# EAGLE design motorBridge (EAGLE 4.16)
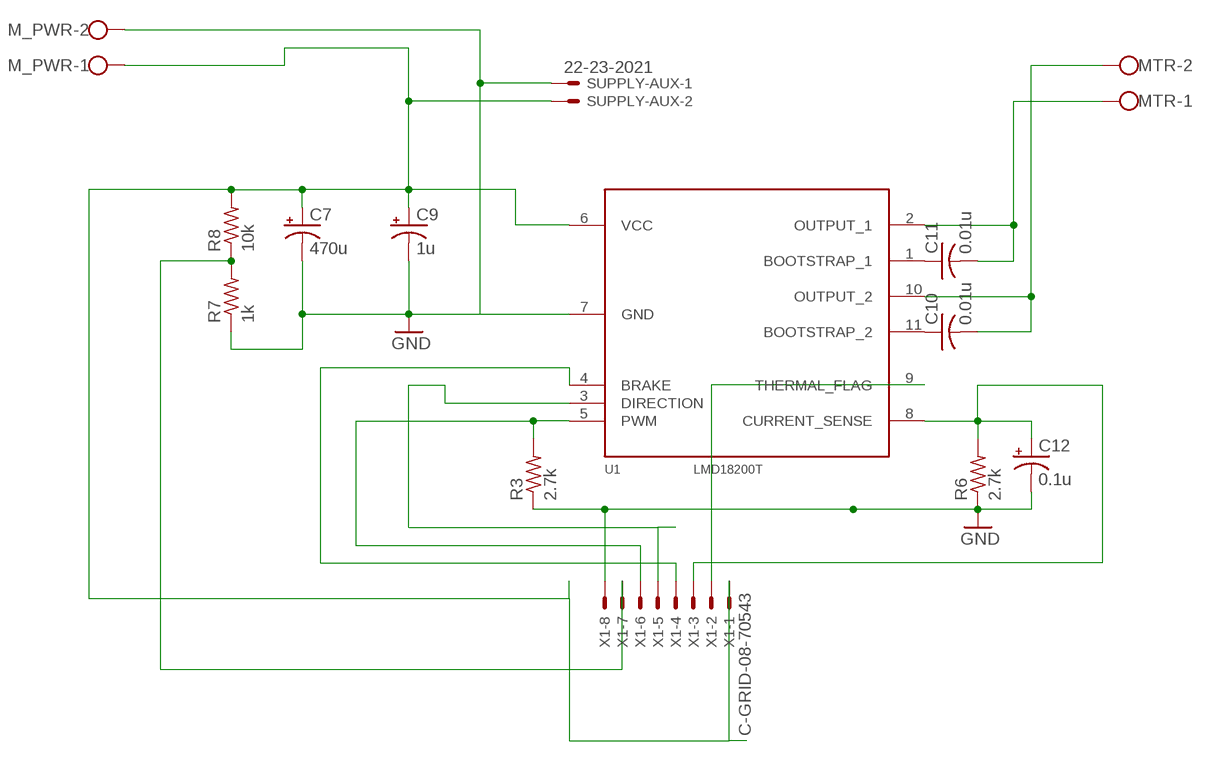
[diagram p0: schematic, sheet 1]

## Parts
C7  470u  CPOL-USE3.5-10  [E3,5-10]
C9  1u  CPOL-USE2.5-7  [E2,5-7]
C10  0.01u  C-US025-025X050  [C025-025X050]
C11  0.01u  C-US025-025X050  [C025-025X050]
C12  0.1u  CPOL-USE2.5-6  [E2,5-6]
M_PWR  W237-02P  [W237-132]
MTR  W237-02P  [W237-132]
R3  2.7k  R-US_0204/7  [0204/7]
R6  2.7k  R-US_0204/5  [0204/5]
R7  1k  R-US_0204/5  [0204/5]
R8  10k  R-US_0204/2V  [0204V]
SUPPLY-AUX  22-23-2021  [22-23-2021]
U1  LMD18200T  [TO-220-11]
X1  C-GRID-08-70543  [70543-08]

## Nets
GND: C7.- C9.- C12.- M_PWR.2 R3.1 R6.1 R7.1 SUPPLY-AUX.1 U1.7(GND) X1.8
N$1: R7.2 R8.1 X1.7
N$2: U1.9(THERMAL_FLAG) X1.2
N$4: C10.2 MTR.2 U1.10(OUTPUT_2)
N$5: C11.2 MTR.1 U1.2(OUTPUT_1)
N$11: C12.+ R6.2 U1.8(CURRENT_SENSE) X1.3
N$31: U1.3(DIRECTION) X1.5
N$55: C7.+ C9.+ M_PWR.1 R8.2 SUPPLY-AUX.2 U1.6(VCC) X1.1
N$63: U1.4(BRAKE) X1.4
N$168: C11.1 U1.1(BOOTSTRAP_1)
N$169: C10.1 U1.11(BOOTSTRAP_2)
N$172: R3.2 U1.5(PWM) X1.6

## Library data of the parts
C7 C9 C12 = rcl:CPOL-US: POLARIZED CAPACITOR, American symbol
C10 C11 = rcl:C-US: CAPACITOR, American symbol
M_PWR MTR = con-wago-508:W237-02P: WAGO SREW CLAMP
R3 R6-R8 = rcl:R-US_: RESISTOR, American symbol
SUPPLY-AUX = con-molex:22-23-2021: .100" (2.54mm) Center Header - 2 Pin
U1 = lmd1820x:LMD18200: National Semiconductor LMD18200 3A, 55V H-Bridge
X1 = con-molex:C-GRID-08: CONNECTOR wire to board 2.54 mm (0.100") pitch header

## Board
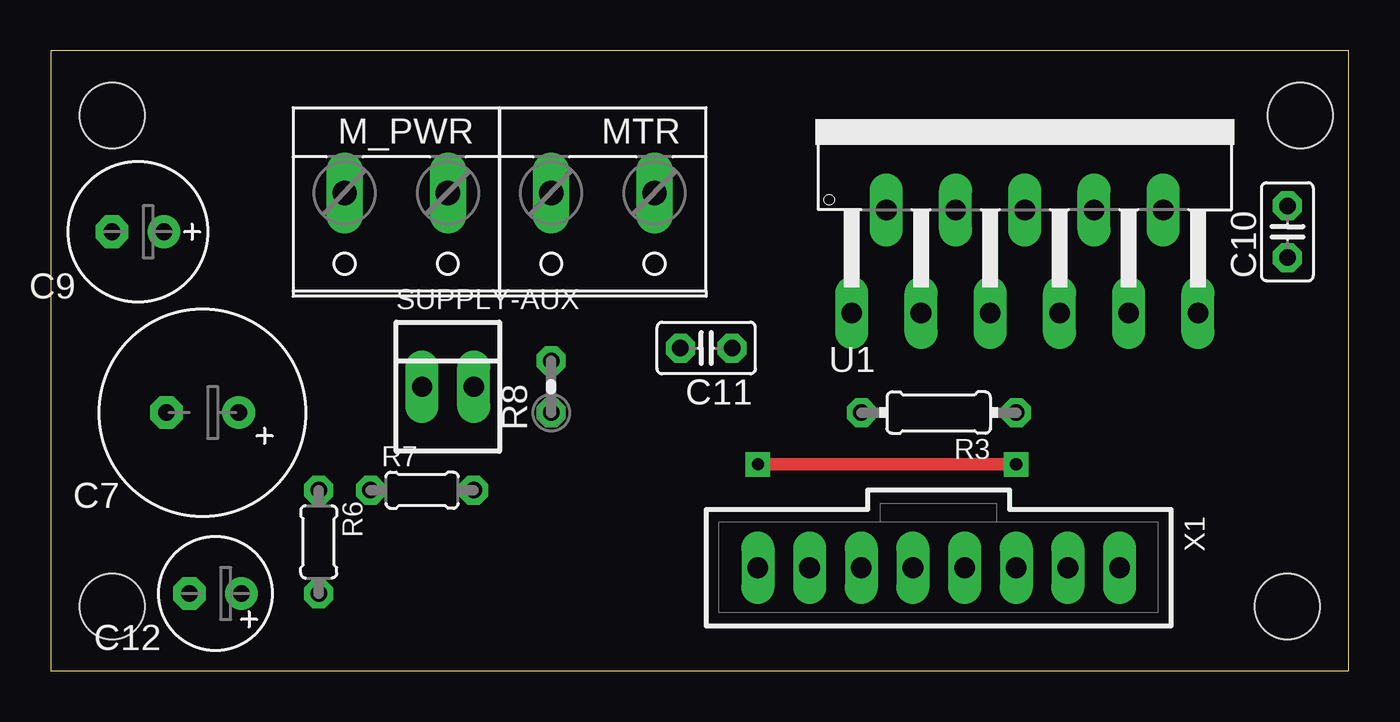
[diagram p1: board, top side]
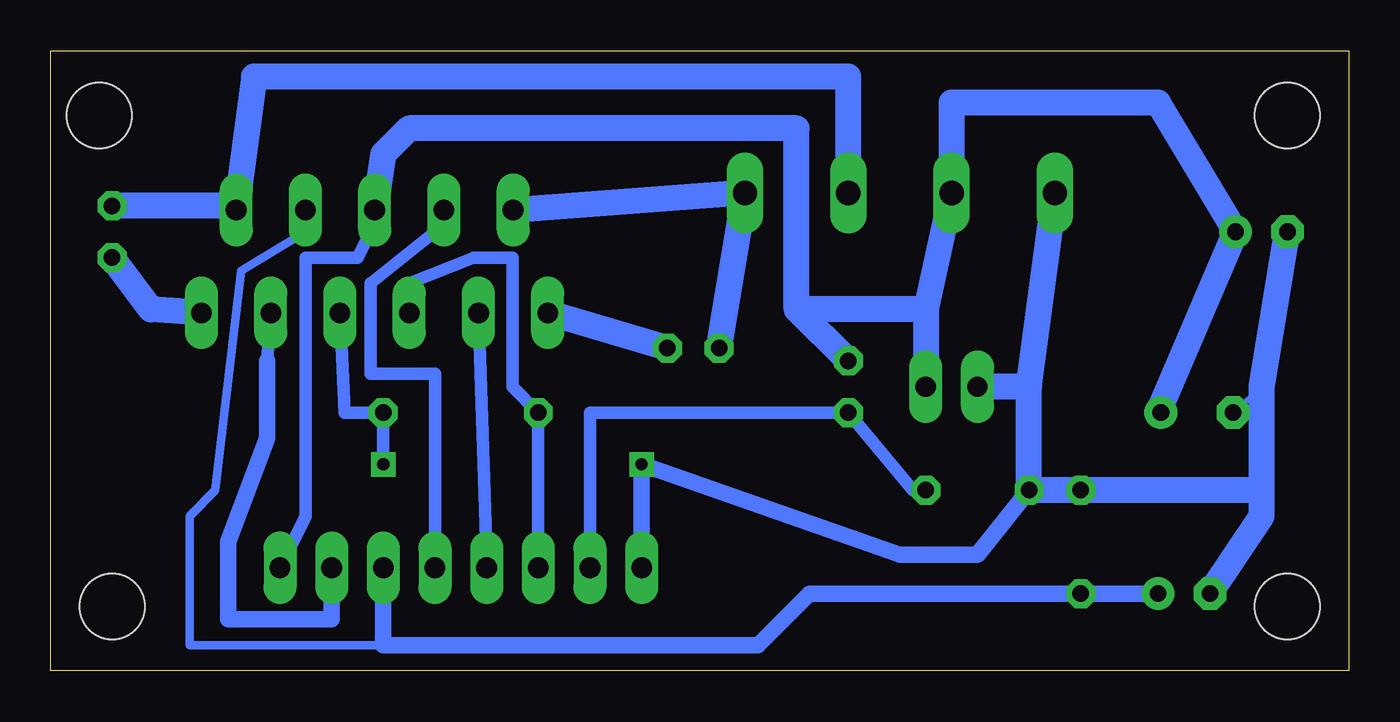
[diagram p2: board, bottom side, seen from below]

Size 63.8 x 30.47 mm. Coordinates in mm from the lower left corner, seen from the top.
Outline: 0,0 63.8,0 63.8,30.47 0,30.47 0,0
Copper layers (1*16): Top 0.035mm / dielectric 1.5mm / Bottom 0.035mm
Design rules "dave": minimum track width 12mil, minimum drill 24mil, track to track 12mil, track to pad 12mil, pad to pad 12mil, via to via 12mil, smd to smd 8mil, copper to edge 40mil, drill to drill 12mil, minimum pad ring 12mil, minimum via ring 12mil, stop-mask expansion 4mil, vias tented up to drill 0mil, thermal gap 10mil
Holes 3.2 mm at 3.01,27.3 61.43,27.3 60.8,3.17 3.01,3.17

### Footprints (pad centres in the part's own frame; a part is rotated, then mirrored left to right if it is on the bottom)
E3,5-10 = drill 0.813 pad 1.6 round: + -1.778,0 | drill 0.813 pad 1.6 octagon: - 1.778,0
E2,5-7 = drill 0.813 pad 1.6 round: + -1.27,0 | drill 0.813 pad 1.6 octagon: - 1.27,0
C025-025X050 = drill 0.813 octagon: 1 -1.27,0; 2 1.27,0
E2,5-6 = drill 0.813 pad 1.6 round: + -1.27,0 | drill 0.813 pad 1.6 octagon: - 1.27,0
W237-132 = drill 1.194 long: 1 -2.54,-0.635; 2 2.54,-0.635
0204/7 = drill 0.813 octagon: 1 -3.81,0; 2 3.81,0
0204/5 = drill 0.813 octagon: 1 -2.54,0; 2 2.54,0
0204V = drill 0.813 octagon: 1 -1.27,0; 2 1.27,0
22-23-2021 = drill 1 long: 1 -1.27,0; 2 1.27,0
TO-220-11 = drill 1.016 long: 1 -8.084,-2.718; 2 -6.382,2.337; 3 -4.68,-2.718; 4 -2.978,2.337; 5 -1.276,-2.718; 6 0.425,2.337; 7 2.127,-2.718; 8 3.829,2.337; 9 5.531,-2.718; 10 7.233,2.337; 11 8.934,-2.718
70543-08 = drill 1.016 long: 1 -8.89,0; 2 -6.35,0; 3 -3.81,0; 4 -1.27,0; 5 1.27,0; 6 3.81,0; 7 6.35,0; 8 8.89,0

### Placement (x,y rotation side)
C7  7.46,12.69 180 top
C9  4.28,21.59 180 top
C10  60.8,21.59 90 top
C11  32.22,15.87 180 top
C12  8.09,3.81 180 top
M_PWR  16.98,22.86 180 top
MTR  27.14,22.86 180 top
R3  43.65,12.69 180 top
R6  13.17,6.34 270 top
R7  18.25,8.88 0 top
R8  24.6,13.96 90 top
SUPPLY-AUX  19.52,13.96 0 top
U1  47.46,20.32 0 top
X1  43.65,5.08 180 top

### Tracks (layer width: path | path; a pad name or v marks a point on that pad's centre or on a via)
GND  (via drill 0.6)
  Top 0.61: v34.76,10.15 v47.46,10.15
  Bottom 0.305: 4.28,13.96 C7.-
  Bottom 0.61: U1.7 49.37,12.69 R3.1 v47.46,10.15
  Bottom 0.813: R6.1 R7.1 18.25,5.71 22.06,5.71 v34.76,10.15 X1.8
  Bottom 1.27: C12.- 4.28,7.62 4.28,8.88 | 4.28,8.88 R6.1 R7.1 15.71,13.96 | 4.28,8.88 4.28,13.96 C9.- | 15.71,13.96 SUPPLY-AUX.1 | 15.71,13.96 M_PWR.2
N$1
  Bottom 0.61: R7.2 21.43,8.88 R8.1 37.3,12.69 X1.7
N$2
  Bottom 0.61: 53.18,15.23 U1.9
  Bottom 0.813: 53.18,15.23 53.18,11.42 55.08,6.34 55.08,2.54 50,2.54 X1.2
N$4
  Bottom 0.305: U1.10 55.08,22.86
  Bottom 1.27: 55.08,22.86 C10.2 | MTR.2 24.6,29.21 53.81,29.21 U1.10
N$5
  Bottom 1.27: C11.2 MTR.1 U1.2
N$11
  Bottom 0.406: 51.27,21.59 54.45,19.68 55.72,8.88 56.98,7.62 56.98,1.27 47.46,1.27
  Bottom 0.61: 51.27,21.59 U1.8
  Bottom 0.813: C12.+ R6.2 26.51,3.81 29.05,1.27 47.46,1.27 X1.3
N$31
  Bottom 0.61: X1.5 42.38,5.71 U1.3
N$55
  Bottom 0.305: C7.+ 9.36,12.69
  Bottom 0.61: X1.1 51.27,7.62 51.27,20.32 48.73,20.32 48.09,21.59 U1.6
  Bottom 1.27: 9.36,12.69 C9.+ 9.36,27.94 19.52,27.94 M_PWR.1 20.79,17.78 | 20.79,17.78 27.14,17.78 | 27.14,17.78 R8.2 | 20.79,17.78 SUPPLY-AUX.2 | 27.14,17.78 27.14,26.67 46.19,26.67 47.46,25.39 U1.6
N$63
  Bottom 0.61: U1.4 44.92,21.59 48.09,19.05 48.09,14.6 44.92,14.6 X1.4
N$168
  Bottom 1.27: C11.1 U1.1
N$169
  Bottom 1.27: C10.1 58.89,17.78 U1.11
N$172
  Bottom 0.305: 46.19,19.05 U1.5
  Bottom 0.61: X1.6 R3.2 41.11,13.96 41.11,20.32 43.02,20.32 46.19,19.05